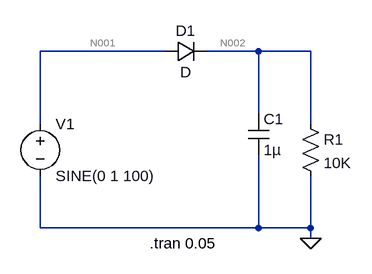
[diagram p0: schematic half wave rectifier without C.asc]
half wave rectifier without C.asc, the LTspice schematic file:
Version 4
SHEET 1 880 680
WIRE 192 0 0 0
WIRE 336 0 256 0
WIRE 416 0 336 0
WIRE 336 96 336 0
WIRE 0 112 0 0
WIRE 416 112 416 0
WIRE 0 272 0 192
WIRE 336 272 336 160
WIRE 336 272 0 272
WIRE 416 272 416 192
WIRE 416 272 336 272
WIRE 416 288 416 272
FLAG 416 288 0
SYMBOL voltage 0 96 R0
WINDOW 123 0 0 Left 0
WINDOW 39 0 0 Left 0
SYMATTR InstName V1
SYMATTR Value SINE(0 1 100)
SYMBOL diode 192 16 R270
WINDOW 0 32 32 VTop 2
WINDOW 3 0 32 VBottom 2
SYMATTR InstName D1
SYMBOL res 400 96 R0
SYMATTR InstName R1
SYMATTR Value 10K
SYMBOL cap 320 96 R0
SYMATTR InstName C1
SYMATTR Value 1µ
TEXT 168 296 Left 2 !.tran 0.05

The netlist it stands for:
* half wave rectifier without C.asc
V1 N001 0 SINE(0 1 100)
D1 N001 N002 D
R1 N002 0 10K
C1 N002 0 1µ
.model D D
.lib standard.dio
.tran 0.05
.backanno
.end

* Results of the author's LTspice run, read from the files saved beside the schematic
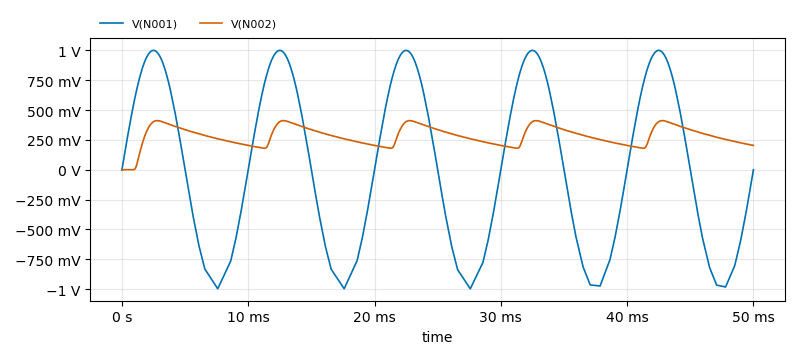
[diagram p1: Transient Analysis of half wave rectifier without C.asc, plotted from the saved traces]
* Transient Analysis, 1 run:
*   V(N001): min -997.8 mV, max 1 V, average 5.719 mV, rms 702.2 mV, last 0 V
*   V(N002): min 0 V, max 411.4 mV, average 282.2 mV, rms 294.4 mV, last 203.5 mV